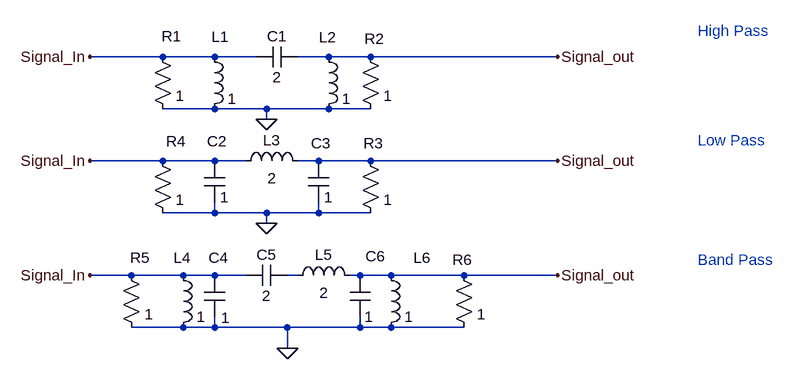
[diagram p0: schematic Filter_List.asc]
Filter_List.asc, the LTspice schematic file:
Version 4
SHEET 1 996 680
WIRE 48 64 -64 64
WIRE 128 64 48 64
WIRE 192 64 128 64
WIRE 304 64 256 64
WIRE 368 64 304 64
WIRE 656 64 368 64
WIRE 128 144 48 144
WIRE 208 144 128 144
WIRE 304 144 208 144
WIRE 368 144 304 144
WIRE 208 160 208 144
WIRE 48 224 -64 224
WIRE 128 224 48 224
WIRE 176 224 128 224
WIRE 288 224 256 224
WIRE 368 224 288 224
WIRE 656 224 368 224
WIRE 128 304 128 288
WIRE 128 304 48 304
WIRE 208 304 128 304
WIRE 288 304 288 288
WIRE 288 304 208 304
WIRE 368 304 288 304
WIRE 208 320 208 304
WIRE 0 400 -64 400
WIRE 80 400 0 400
WIRE 128 400 80 400
WIRE 176 400 128 400
WIRE 256 400 240 400
WIRE 352 400 336 400
WIRE 400 400 352 400
WIRE 512 400 400 400
WIRE 656 400 512 400
WIRE 80 480 0 480
WIRE 128 480 128 464
WIRE 128 480 80 480
WIRE 240 480 128 480
WIRE 352 480 352 464
WIRE 352 480 240 480
WIRE 400 480 352 480
WIRE 512 480 400 480
WIRE 240 512 240 480
FLAG 240 512 0
FLAG 208 320 0
FLAG 208 160 0
FLAG -64 64 Signal_In
FLAG -64 224 Signal_In
FLAG -64 400 Signal_In
FLAG 656 64 Signal_out
FLAG 656 224 Signal_out
FLAG 656 400 Signal_out
SYMBOL ind 112 48 R0
WINDOW 0 11 -15 Left 2
SYMATTR InstName L1
SYMATTR Value 1
SYMBOL cap 256 48 R90
WINDOW 0 0 32 VBottom 2
WINDOW 3 32 32 VTop 2
SYMATTR InstName C1
SYMATTR Value 2
SYMBOL ind 288 48 R0
WINDOW 0 1 -14 Left 2
SYMATTR InstName L2
SYMATTR Value 1
SYMBOL cap 112 224 R0
WINDOW 0 4 -30 Left 2
SYMATTR InstName C2
SYMATTR Value 1
SYMBOL ind 160 240 R270
WINDOW 0 32 56 VTop 2
WINDOW 3 5 56 VBottom 2
SYMATTR InstName L3
SYMATTR Value 2
SYMBOL cap 272 224 R0
WINDOW 0 4 -27 Left 2
SYMATTR InstName C3
SYMATTR Value 1
SYMBOL cap 112 400 R0
WINDOW 0 7 -27 Left 2
WINDOW 3 26 65 Left 2
SYMATTR InstName C4
SYMATTR Value 1
SYMBOL ind 64 384 R0
WINDOW 0 1 -11 Left 2
SYMATTR InstName L4
SYMATTR Value 1
SYMBOL cap 240 384 R90
WINDOW 0 0 32 VBottom 2
WINDOW 3 32 32 VTop 2
SYMATTR InstName C5
SYMATTR Value 2
SYMBOL ind 240 416 R270
WINDOW 0 32 56 VTop 2
WINDOW 3 5 56 VBottom 2
SYMATTR InstName L5
SYMATTR Value 2
SYMBOL cap 336 400 R0
WINDOW 0 24 -29 Left 2
WINDOW 3 23 64 Left 2
SYMATTR InstName C6
SYMATTR Value 1
SYMBOL ind 384 384 R0
WINDOW 0 50 -11 Left 2
SYMATTR InstName L6
SYMATTR Value 1
SYMBOL res 32 48 R0
WINDOW 0 14 -16 Left 2
SYMATTR InstName R1
SYMATTR Value 1
SYMBOL res 352 48 R0
WINDOW 0 7 -12 Left 2
SYMATTR InstName R2
SYMATTR Value 1
SYMBOL res 352 208 R0
WINDOW 0 5 -11 Left 2
SYMATTR InstName R3
SYMATTR Value 1
SYMBOL res 32 208 R0
WINDOW 0 21 -14 Left 2
SYMATTR InstName R4
SYMATTR Value 1
SYMBOL res -16 384 R0
WINDOW 0 14 -11 Left 2
SYMATTR InstName R5
SYMATTR Value 1
SYMBOL res 496 384 R0
WINDOW 0 -2 -8 Left 2
SYMATTR InstName R6
SYMATTR Value 1
TEXT 872 24 Left 2 ;High Pass
TEXT 872 192 Left 2 ;Low Pass
TEXT 872 376 Left 2 ;Band Pass

The netlist it stands for:
* Filter_List.asc
L1 Signal_In 0 1
C1 Signal_out Signal_In 2
L2 Signal_out 0 1
C2 Signal_In 0 1
L3 Signal_In Signal_out 2
C3 Signal_out 0 1
C4 Signal_In 0 1
L4 Signal_In 0 1
C5 N001 Signal_In 2
L5 N001 Signal_out 2
C6 Signal_out 0 1
L6 Signal_out 0 1
R1 Signal_In 0 1
R2 Signal_out 0 1
R3 Signal_out 0 1
R4 Signal_In 0 1
R5 Signal_In 0 1
R6 Signal_out 0 1
* High Pass
* Low Pass
* Band Pass
.backanno
.end